# Altium schematic sheet Sheet1.SchDoc
size A3; SheetNumber: 1; SheetTotal: 1
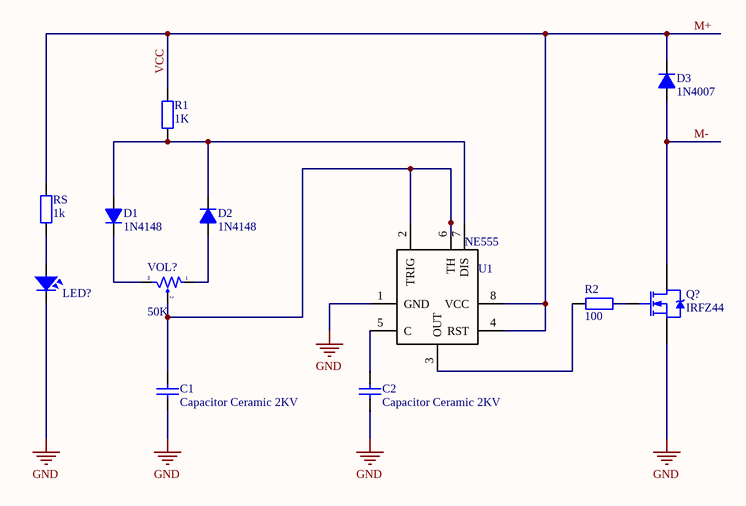
[diagram p0: Sheet1.SchDoc]

## Parts
C1  Capacitor Ceramic 2KV  [103/2KV]
C2  Capacitor Ceramic 2KV  [103/2KV]
D1  1N4148  [D1A]
D2  1N4148  [D1A]
D3  1N4007  [D1A]
LED?  LED  [LED-3]  (value not drawn)
Q?  IRFZ44  [QTO-220H3]
R1  1K  [R1/4W]
R2  100  [R1/4W]
RS  1k  [R1/4W]
U1  NE555  [DIP8]
VOL?  50K  [VOL-S]

## Nets
GND: C1.2 C2.1 LED?.2 Q?.3(S) U1.1(GND)
M+: D3.2(K) R1.1 RS.2 U1.4(RST) U1.8(VCC)  [also labelled VCC]
M-: D3.1(A) Q?.2(D)
NetC1_1: C1.1 U1.2(TRIG) U1.6(TH) VOL?.2
NetC2_2: C2.2 U1.5(C)
NetD1_1: D1.1(A) D2.2(K) R1.2 U1.7(DIS)
NetD1_2: D1.2(K) VOL?.3
NetD2_1: D2.1(A) VOL?.1
NetLED?_1: LED?.1 RS.1
NetQ?_1: Q?.1(G) R2.1
NetR2_2: R2.2 U1.3(OUT)

## Library data of the parts
C1 C2 = Cap2KV: Published: 8-Jun-2000; LatestRevisionDate: 17-Jul-2002; LatestRevisionNote: Re-released for DXP Platform.; PackageReference: RAD-0.3; Publisher: Altium Limited
D1 D2 = D1A: Diode 1A; Value: 1N4007
D3 = D1A: Diode 1A; Value: 1N4007
LED? = LED: LED Single colour Green and Red; Value: LED 3 ly Single Colour
Q? = IRFZ44: HEXFET N-Channel Power MOSFET
R1 R2 RS = R1/4W: Resistor 1/4W; Value: R1/4W - 1K
U1 = NE555: TIMER IC; Manufacturer Part Number: NE555DT; Manufacturer: STMicroelectronics; Frequency: 500kHz; Voltage - Supply: 4.5 V ~ 16 V; Current: 200mA; Supplier 1: Digi-Key; Supplier Part Number 1: 497-1962-2-ND; Supplier: Digi-Key; Category: Integrated Circuits (ICs); Supplier Part Number: 497-1962-2-ND; Package / Case: 8-SOIC (3.9mm Width); Packaging: Tape & Reel (TR); RoHS: RoHS Compliant; Operating Temperature: 0°C ~ 70°C; Count: -; Type: 555 Type, Timer/Oscillator (Single)
VOL? = VOL-S: Var Resistor; Value: Volume 50k